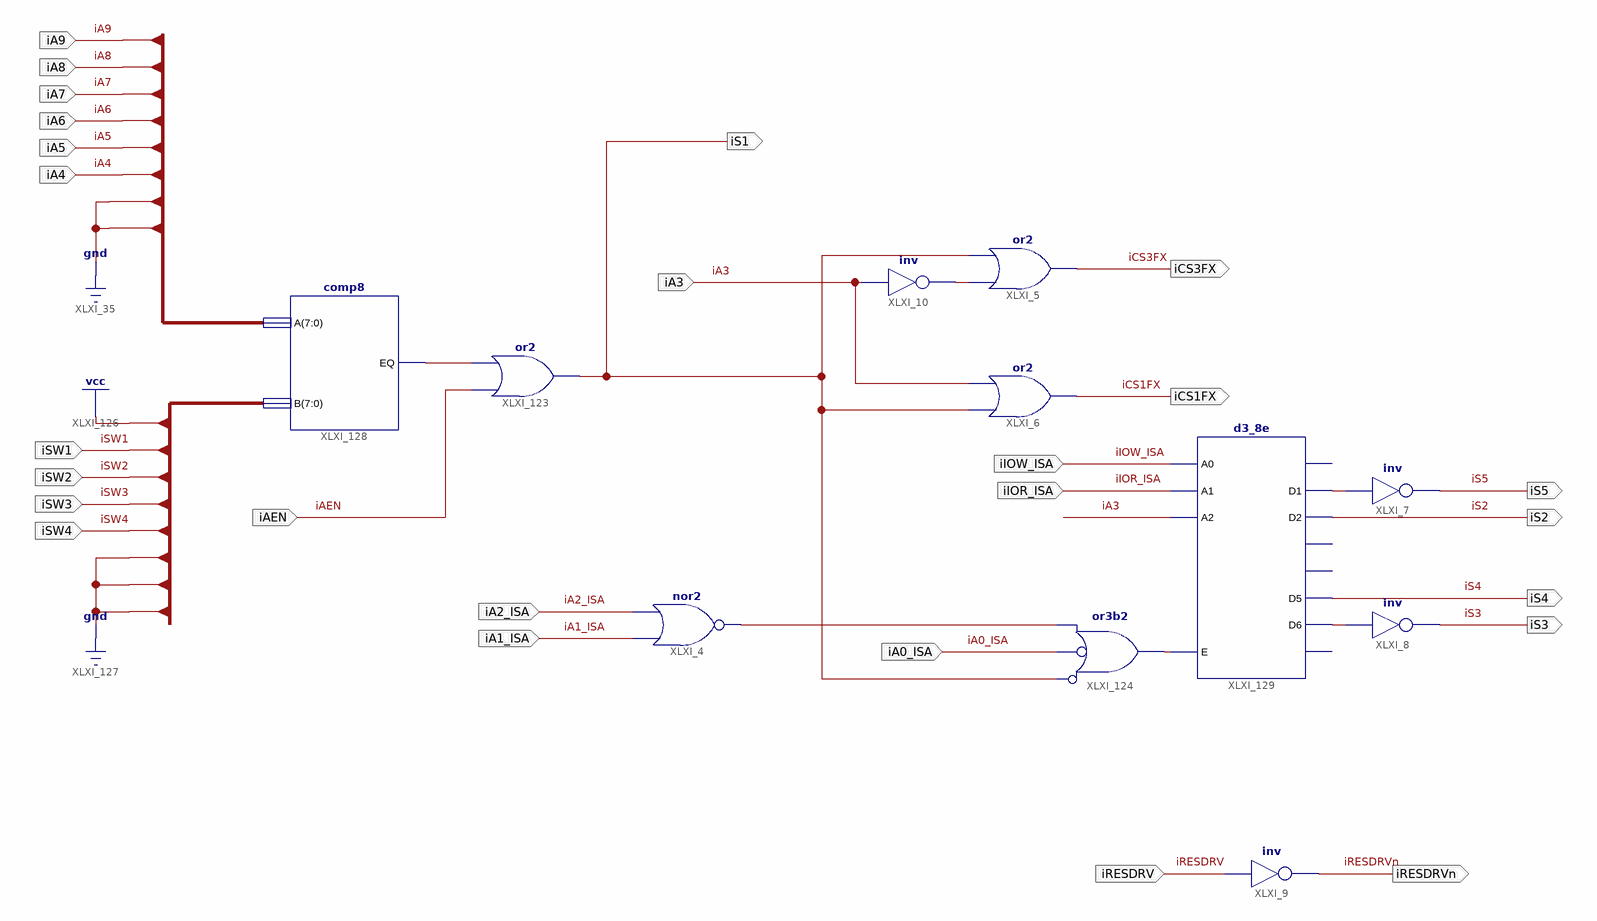
[diagram p0: schematic sheet 1]
// Xilinx ISE schematic IDE_DECODE.sch (xc9500) as structural Verilog: 11 symbols, 26 ports
module IDE_DECODE (
  input  iAEN,
  input  iA2_ISA,
  input  iA1_ISA,
  input  iA3,
  input  iIOW_ISA,
  input  iIOR_ISA,
  input  iA0_ISA,
  input  iRESDRV,
  input  iA9,
  input  iA8,
  input  iA7,
  input  iA6,
  input  iA5,
  input  iA4,
  input  iSW1,
  input  iSW2,
  input  iSW3,
  input  iSW4,
  output iS1,
  output iS5,
  output iS2,
  output iS4,
  output iS3,
  output iCS3FX,
  output iCS1FX,
  output iRESDRVn
);

  wire XLXN_1, XLXN_2, XLXN_111, XLXN_112, XLXN_113, XLXN_138;

  or XLXI_5 (iCS3FX, XLXN_2, iS1);
  or XLXI_6 (iCS1FX, iS1, iA3);
  not XLXI_7 (iS5, XLXN_1);
  not XLXI_8 (iS3, XLXN_138);
  not XLXI_10 (XLXN_2, iA3);
  or XLXI_123 (iS1, iAEN, XLXN_113);
  or XLXI_124 (XLXN_111, ~iS1, ~iA0_ISA, XLXN_112);  // or3b2
  nor XLXI_4 (XLXN_112, iA1_ISA, iA2_ISA);
  not XLXI_9 (iRESDRVn, iRESDRV);
  comp8 XLXI_128 (.A({iA9, iA8, iA7, iA6, iA5, iA4, 2'b00}), .B({1'b1, iSW1, iSW2, iSW3, iSW4, 3'b000}), .EQ(XLXN_113));
  d3_8e XLXI_129 (
    .A0(iIOW_ISA), .A1(iIOR_ISA), .A2(iA3), .E(XLXN_111), .D1(XLXN_1), .D2(iS2), .D5(iS4), .D6(XLXN_138));  // open: D0, D3, D4, D7
endmodule
